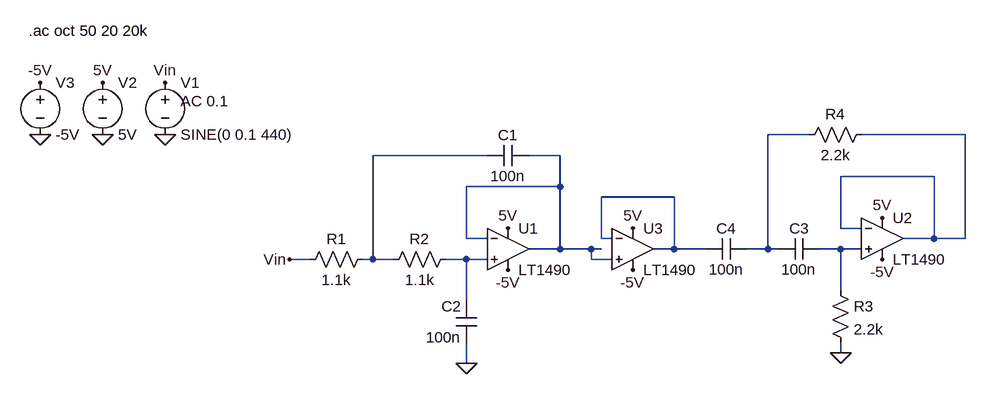
[diagram p0: schematic SallenKeyButterworthBandpass.asc]
SallenKeyButterworthBandpass.asc, the LTspice schematic file:
Version 4
SHEET 1 880 680
WIRE 560 0 496 0
WIRE 800 0 640 0
WIRE 64 32 -112 32
WIRE 176 32 128 32
WIRE 752 64 608 64
WIRE 176 80 176 32
WIRE 176 80 32 80
WIRE 352 96 240 96
WIRE 608 144 608 64
WIRE 640 144 608 144
WIRE 32 160 32 80
WIRE 64 160 32 160
WIRE 240 160 240 96
WIRE 256 160 240 160
WIRE 752 160 752 64
WIRE 752 160 704 160
WIRE 800 160 800 0
WIRE 800 160 752 160
WIRE 176 176 176 80
WIRE 176 176 128 176
WIRE 224 176 176 176
WIRE 240 176 224 176
WIRE 352 176 352 96
WIRE 352 176 320 176
WIRE 400 176 352 176
WIRE 496 176 496 0
WIRE 496 176 464 176
WIRE 512 176 496 176
WIRE 608 176 576 176
WIRE 640 176 608 176
WIRE -208 192 -240 192
WIRE -112 192 -112 32
WIRE -112 192 -128 192
WIRE -80 192 -112 192
WIRE 32 192 0 192
WIRE 64 192 32 192
WIRE 224 192 224 176
WIRE 256 192 224 192
WIRE 608 240 608 176
WIRE 32 256 32 192
WIRE 608 336 608 320
WIRE 32 352 32 320
FLAG 32 352 0
FLAG -432 0 0
FLAG -432 -80 Vin
FLAG -624 0 0
FLAG -528 0 0
FLAG -528 -80 5V
FLAG -624 -80 -5V
FLAG 96 208 -5V
FLAG 96 144 5V
FLAG -240 192 Vin
FLAG 608 336 0
FLAG 672 192 -5V
FLAG 672 128 5V
FLAG 288 208 -5V
FLAG 288 144 5V
SYMBOL Opamps\\LT1490 96 112 R0
SYMATTR InstName U1
SYMBOL res -112 176 R90
WINDOW 0 0 56 VBottom 2
WINDOW 3 32 56 VTop 2
SYMATTR InstName R1
SYMATTR Value 1.1k
SYMBOL res 16 176 R90
WINDOW 0 0 56 VBottom 2
WINDOW 3 32 56 VTop 2
SYMATTR InstName R2
SYMATTR Value 1.1k
SYMBOL cap 128 16 R90
WINDOW 0 0 32 VBottom 2
WINDOW 3 32 32 VTop 2
SYMATTR InstName C1
SYMATTR Value 100n
SYMBOL cap 48 320 R180
WINDOW 0 24 56 Left 2
WINDOW 3 24 8 Left 2
SYMATTR InstName C2
SYMATTR Value 100n
SYMBOL voltage -432 -96 R0
WINDOW 123 24 44 Left 2
WINDOW 39 0 0 Left 0
SYMATTR InstName V1
SYMATTR Value SINE(0 0.1 440)
SYMATTR Value2 AC 0.1
SYMBOL voltage -528 -96 R0
WINDOW 123 0 0 Left 0
WINDOW 39 0 0 Left 0
SYMATTR InstName V2
SYMATTR Value 5V
SYMBOL voltage -624 -96 R0
WINDOW 123 0 0 Left 0
WINDOW 39 0 0 Left 0
SYMATTR InstName V3
SYMATTR Value -5V
SYMBOL Opamps\\LT1490 672 96 R0
SYMATTR InstName U2
SYMBOL res 592 224 R0
SYMATTR InstName R3
SYMATTR Value 2.2k
SYMBOL cap 576 160 R90
WINDOW 0 0 32 VBottom 2
WINDOW 3 32 32 VTop 2
SYMATTR InstName C3
SYMATTR Value 100n
SYMBOL cap 464 160 R90
WINDOW 0 0 32 VBottom 2
WINDOW 3 32 32 VTop 2
SYMATTR InstName C4
SYMATTR Value 100n
SYMBOL res 656 -16 R90
WINDOW 0 0 56 VBottom 2
WINDOW 3 32 56 VTop 2
SYMATTR InstName R4
SYMATTR Value 2.2k
SYMBOL Opamps\\LT1490 288 112 R0
SYMATTR InstName U3
TEXT -642 -160 Left 2 !.ac oct 50 20 20k

The netlist it stands for:
* SallenKeyButterworthBandpass.asc
XU1 N007 N004 5V -5V N004 LT1490  ; pins In+ In- V+ V- OUT
R1 N003 Vin 1.1k
R2 N007 N003 1.1k
C1 N004 N003 100n
C2 0 N007 100n
V1 Vin 0 SINE(0 0.1 440) AC 0.1
V2 5V 0 5V
V3 -5V 0 -5V
XU2 N006 N002 5V -5V N002 LT1490  ; pins In+ In- V+ V- OUT
R3 N006 0 2.2k
C3 N006 N001 100n
C4 N001 N005 100n
R4 N002 N001 2.2k
XU3 N004 N005 5V -5V N005 LT1490  ; pins In+ In- V+ V- OUT
.ac oct 50 20 20k
.backanno
.end